# Altium schematic sheet PART1_NC.SchDoc: 非连接器件引脚
size A4; Author: 崔 敖; 李尚文; Revision: B1.0; SheetNumber: 1
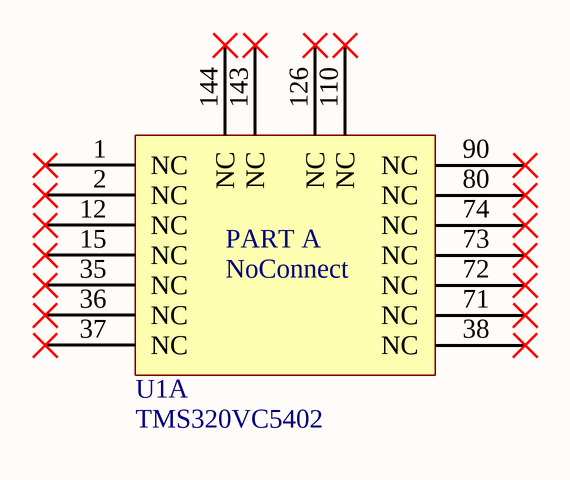
[diagram p0: PART1_NC.SchDoc]

## Parts
U1  TMS320VC5402  [TMS320VC5401_PQFP144]  (part A of 5)

## Nets

Not connected (* = marked no-connect by the designer): U1 1(NC)* 2(NC)* 12(NC)* 15(NC)* 35(NC)* 36(NC)* 37(NC)* 38(NC)* 71(NC)* 72(NC)* 73(NC)* 74(NC)* 80(NC)* 90(NC)* 110(NC)* 126(NC)* 143(NC)* 144(NC)*

## Notes on the sheet
- 图名：
- 图号：
- 大小： A4
- 单位：
- 四川大学电子信息学院
- 制图：
- 共
- 图
- 版本：
- 日期：
- (in symbol TMS320VC5402, part A) PART A; NoConnect